# EAGLE design Galago-0BAB040D (EAGLE 5.10)
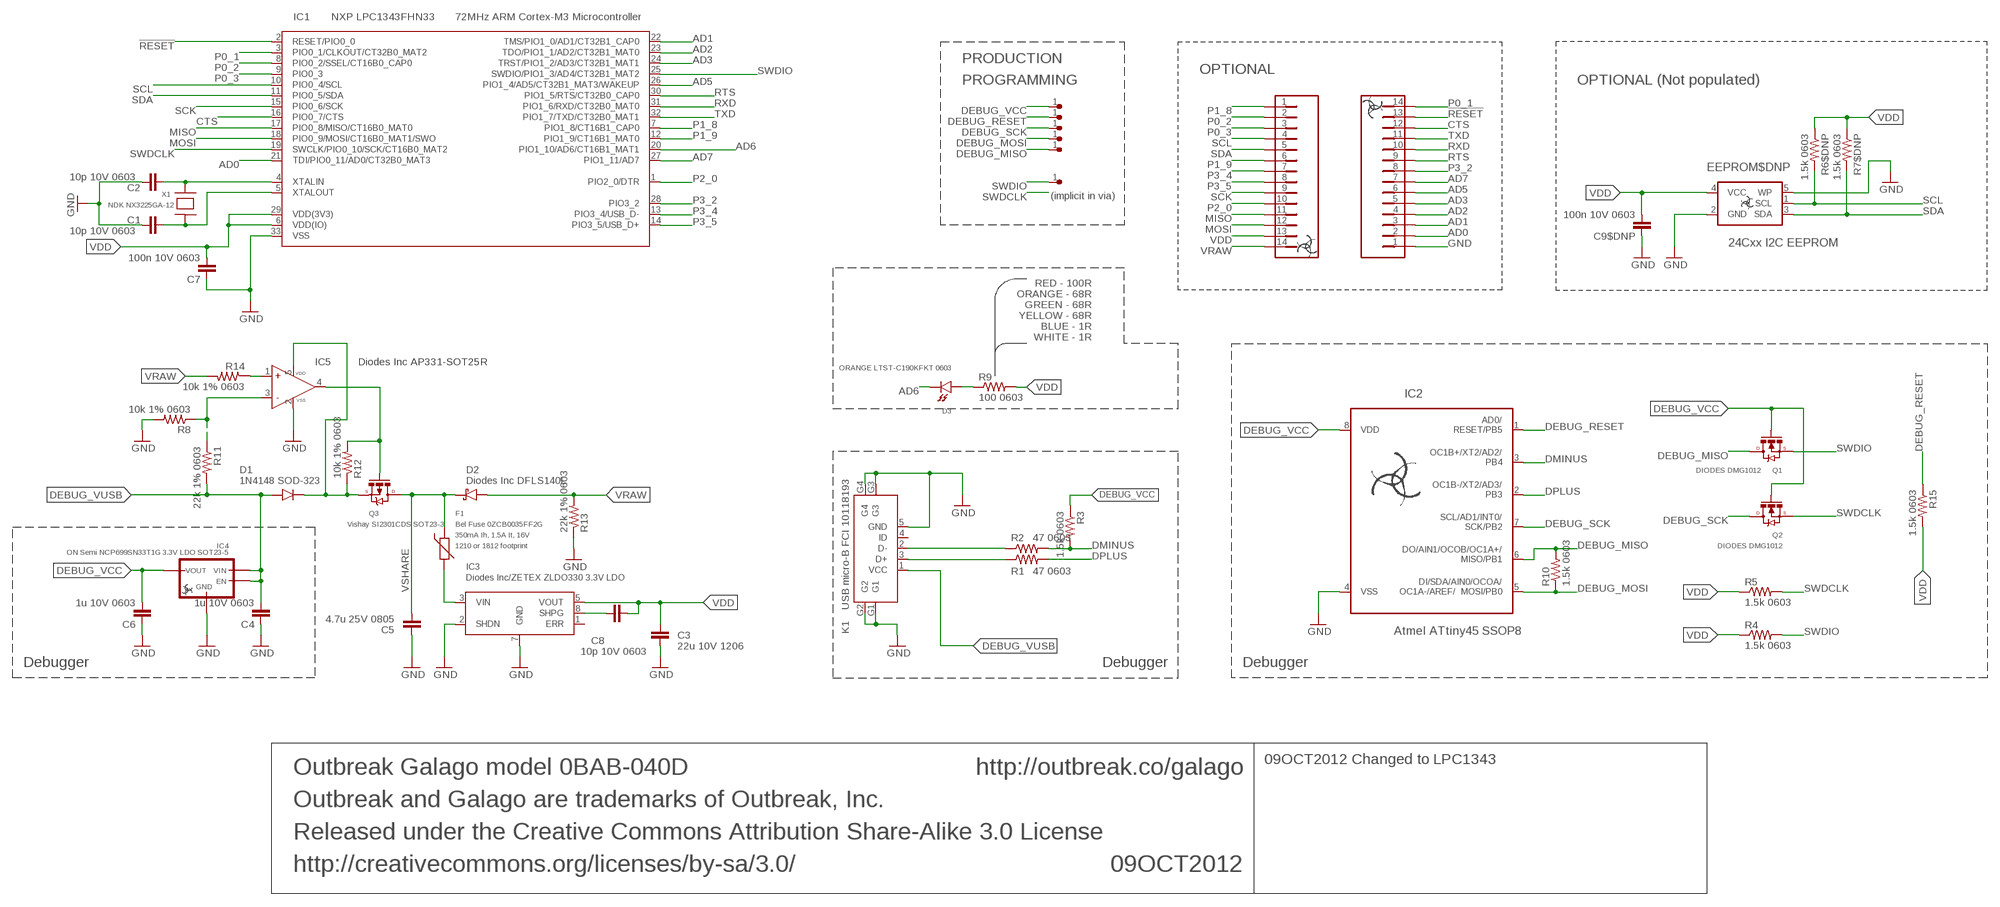
[diagram p0: schematic, sheet 1]

## Parts
09OCT2012  Outbreak Galago model 0BAB-040D  INFO-BLOCK  [INFO-BLOCK]
C1  10p 10V 0603  CAP-0603  [0603]
C2  10p 10V 0603  CAP-0603  [0603]
C3  22u 10V 1206  CAP-1206  [1206]
C4  1u 10V 0603  CAP-0603  [0603]
C5  4.7u 25V 0805  CAP-0805  [0805]
C6  1u 10V 0603  CAP-0603  [0603]
C7  100n 10V 0603  CAP-0603  [0603]
C8  10p 10V 0603  CAP-0603  [0603]
C9$DNP  100n 10V 0603  CAP-0603-MIN  [0603-MIN]
D1  1N4148 SOD-323  DIODE-SOD323  [SOD-323]
D2  Diodes Inc DFLS140L  DIODE-SCHOTTKY-POWERDI-123  [DIODE-SMT-POWERDI-123]
D3  ORANGE LTST-C190KFKT 0603  LED-0603  [0603-DIODE]
EEPROM$DNP  24Cxx I2C EEPROM  EEPROM-I2C-MCP-24AAXX/24LCXX  [SOT23-5]
F1  Bel Fuse 0ZCB0035FF2G  PTC-1812-(4532-METRIC)  [1812-(4532-METRIC)-PTC]
IC1  NXP LPC1343FHN33  LPC13XXFHN33  [HVQFN33-7X7MM]
IC2  Atmel ATtiny45 SSOP8  AVR-ATTINY25/45/85-TSSOP8  [TSSOP8]
IC3  Diodes Inc/ZETEX ZLDO330 3.3V LDO  LDO-REGULATOR-FIXED-ZETEX-ZLDO  [SM8-ZETEX]
IC4  ON Semi NCP699SN33T1G 3.3V LDO SOT23-5  LDO-REGULATOR-FIXED-WITH-ENABLE-ONSEMI-NCP699  [SOT23-5]
IC5  Diodes Inc AP331-SOT25R  COMPARATOR-SINGLE-DIODES-AP331-SOT25R  [SOT23-5]
K1  USB micro-B FCI 10118193  USB-5-PIN-MICROB-FCI-10118193  [USB-MICROB-FCI-10118193]
K2$DNP  HEADER-1X14-NO-SILK-CHUNKY  [HEADER-1X14-NO-SILK-CHUNKY]
K3$DNP  HEADER-1X14-NO-SILK-CHUNKY  [HEADER-1X14-NO-SILK-CHUNKY]
Q1  DIODES DMG1012  MOSFET-N-CHANNEL-VISHAY-SI1032R-STRETCHED  [SC-75A-STRETCHED]
Q2  DIODES DMG1012  MOSFET-N-CHANNEL-VISHAY-SI1032R-STRETCHED  [SC-75A-STRETCHED]
Q3  Vishay SI2301CDS SOT23-3  MOSFET-P-CHANNEL-VISHAY-SI2301  [SOT23-3]
R1  47 0603  RESISTOR-0603  [0603]
R2  47 0603  RESISTOR-0603  [0603]
R3  1.5k 0603  RESISTOR-0603-MIN  [0603-MIN]
R4  1.5k 0603  RESISTOR-0603-MIN  [0603-MIN]
R5  1.5k 0603  RESISTOR-0603-MIN  [0603-MIN]
R6$DNP  1.5k 0603  RESISTOR-0603-MIN  [0603-MIN]
R7$DNP  1.5k 0603  RESISTOR-0603-MIN  [0603-MIN]
R8  10k 1% 0603  RESISTOR-0603-MIN  [0603-MIN]
R9  100 0603  RESISTOR-0603-MIN  [0603-MIN]
R10  1.5k 0603  RESISTOR-0603-MIN  [0603-MIN]
R11  22k 1% 0603  RESISTOR-0603-MIN  [0603-MIN]
R12  10k 1% 0603  RESISTOR-0603-MIN  [0603-MIN]
R13  22k 1% 0603  RESISTOR-0603-MIN  [0603-MIN]
R14  10k 1% 0603  RESISTOR-0603-MIN  [0603-MIN]
R15  1.5k 0603  RESISTOR-0603-MIN  [0603-MIN]
U$1  TEST-POINT  TEST-POINT-0.75MM  [TEST-POINT-0.75MM]
U$4  TEST-POINT  TEST-POINT-0.75MM  [TEST-POINT-0.75MM]
U$5  TEST-POINT  TEST-POINT-0.75MM  [TEST-POINT-0.75MM]
U$6  TEST-POINT  TEST-POINT-0.75MM  [TEST-POINT-0.75MM]
U$7  TEST-POINT  TEST-POINT-0.75MM  [TEST-POINT-0.75MM]
U$9  TEST-POINT  TEST-POINT-0.75MM  [TEST-POINT-0.75MM]
X1  NDK NX3225GA-12  CRYSTAL-NDK-NX3225GA  [CRYSTAL-NDK-NX3225GA]

## Nets
!RESET: IC1.2(RESET/PIO0_0) K3$DNP.13
AD0: IC1.21(TDI/PIO0_11/AD0/CT32B0_MAT3) K3$DNP.2
AD1: IC1.22(TMS/PIO1_0/AD1/CT32B1_CAP0) K3$DNP.3
AD2: IC1.23(TDO/PIO1_1/AD2/CT32B1_MAT0) K3$DNP.4
AD3: IC1.24(TRST/PIO1_2/AD3/CT32B1_MAT1) K3$DNP.5
AD5: IC1.26(PIO1_4/AD5/CT32B1_MAT3/WAKEUP) K3$DNP.6
AD6: D3.2(K) IC1.20(PIO1_10/AD6/CT16B1_MAT1)
AD7: IC1.27(PIO1_11/AD7) K3$DNP.7
CTS: IC1.16(PIO0_7/CTS) K3$DNP.12
DEBUG_MISO: IC2.6(MISO/PB1) Q1.3(DRAIN) R10.2 U$7.1
DEBUG_MOSI: IC2.5(MOSI/PB0) R10.1 U$6.1
DEBUG_RESET: IC2.1(RESET/PB5) R15.1 U$1.1
DEBUG_SCK: IC2.7(SCK/PB2) Q2.3(DRAIN) U$5.1
DEBUG_VCC: C6.1 IC2.8(VDD) IC4.5(VOUT) Q1.1(GATE) Q2.1(GATE) R3.1 U$9.1
DEBUG_VUSB: C4.1 D1.A IC4.1(VIN) IC4.3(EN) K1.1(VCC) R11.2
DEBUG_VUSB_PROTECT: D1.K IC5.5(VDD) Q3.2(SOURCE) R12.1
DMINUS: IC2.3(PB4) R2.2 R3.2
DMINUS_CON: K1.2(D-) R2.1
DPLUS: IC2.2(PB3) R1.2
DPLUS_CON: K1.3(D+) R1.1
GATE: IC5.4(OUT) Q3.1(GATE) R12.2
GND: C1.1 C2.1 C3.2 C4.2 C5.2 C6.2 C7.2 C9$DNP.2 EEPROM$DNP.2(GND) EEPROM$DNP.5(WP) IC1.33(VSS) IC2.4(VSS) IC3.2(SHDN) IC3.7(GND) IC4.2(GND) IC5.2(VSS) K1.5(GND) K1.G1 K1.G2 K1.G3 K1.G4 K3$DNP.1 R8.2 R13.1
IC3-SHAPING: C8.1 IC3.8(SHPG)
LED_CURRENT: D3.1(A) R9.1
MISO: IC1.17(PIO0_8/MISO/CT16B0_MAT0) K2$DNP.11
MOSI: IC1.18(PIO0_9/MOSI/CT16B0_MAT1/SWO) K2$DNP.12
P0_1: IC1.3(PIO0_1/CLKOUT/CT32B0_MAT2) K3$DNP.14
P0_2: IC1.8(PIO0_2/SSEL/CT16B0_CAP0) K2$DNP.2
P0_3: IC1.9(PIO0_3) K2$DNP.3
P1_8: IC1.7(PIO1_8/CT16B1_CAP0) K2$DNP.1
P1_9: IC1.12(PIO1_9/CT16B1_MAT0) K2$DNP.6
P2_0: IC1.1(PIO2_0/DTR) K2$DNP.10
P3_2: IC1.28(PIO3_2) K3$DNP.8
P3_4: IC1.13(PIO3_4/USB_D-) K2$DNP.7
P3_5: IC1.14(PIO3_5/USB_D+) K2$DNP.8
RTS: IC1.30(PIO1_5/RTS/CT32B0_CAP0) K3$DNP.9
RXD: IC1.31(PIO1_6/RXD/CT32B0_MAT0) K3$DNP.10
SCK: IC1.15(PIO0_6/SCK) K2$DNP.9
SCL: EEPROM$DNP.1(SCL) IC1.10(PIO0_4/SCL) K2$DNP.4 R6$DNP.2
SDA: EEPROM$DNP.3(SDA) IC1.11(PIO0_5/SDA) K2$DNP.5 R7$DNP.2
SWDCLK: IC1.19(SWCLK/PIO0_10/SCK/CT16B0_MAT2) Q2.2(SOURCE) R5.2
SWDIO: IC1.25(SWDIO/PIO1_3/AD4/CT32B1_MAT2) Q1.2(SOURCE) R4.2 U$4.1
TXD: IC1.32(PIO1_7/TXD/CT32B0_MAT1) K3$DNP.11
VCOMP: IC5.1(+) R14.1
VDD: C3.1 C7.1 C8.2 C9$DNP.1 EEPROM$DNP.4(VCC) IC1.6(VDD(IO)) IC1.29(VDD(3V3)) IC3.5(VOUT) K2$DNP.13 R4.1 R5.1 R6$DNP.1 R7$DNP.1 R9.2 R15.2
VRAW: D2.SMALL(A) K2$DNP.14 R13.2 R14.2
VREF: IC5.3(-) R8.1 R11.1
VSHARE: C5.1 D2.BIG(K) F1.2 Q3.3(DRAIN)
VSHARE_FUSED: F1.1 IC3.3(VIN)
X1: C2.2 IC1.4(XTALIN) X1.3
X2: C1.2 IC1.5(XTALOUT) X1.1
Unconnected: IC3.1(ERR) K1.4(ID)

## Notes on the sheet
- 72MHz ARM Cortex-M3 Microcontroller
- PRODUCTION
- OPTIONAL
- PROGRAMMING | OPTIONAL (Not populated)
- (implicit in via)
- RED - 100R
- ORANGE - 68R
- GREEN - 68R
- YELLOW - 68R
- BLUE - 1R
- WHITE - 1R
- 350mA Ih, 1.5A It, 16V
- 1210 or 1812 footprint
- Debugger | Debugger | Debugger
- 09OCT2012 Changed to LPC1343

## Library data of the parts
09OCT2012 = Outbreak:INFO-BLOCK
C1-C8 C9$DNP = Outbreak:CAP
D1 = Outbreak:DIODE
D2 = Outbreak:DIODE-SCHOTTKY
D3 = Outbreak:LED
EEPROM$DNP = Outbreak:EEPROM-I2C
F1 = Outbreak:PTC
IC1 = Outbreak:LPC13XXFHN33: LPC1313 72 MHz 32-bit ARM Cortex-M3 based microcontroller featuring a high level of integration and low power consumption. 32 kB Flash, 8 kB SRAM MarcVl - Datasheet available on www.nxp.com
IC2 = Outbreak:AVR-ATTINY25/45/85
IC3 = Outbreak:LDO-REGULATOR-FIXED-ZETEX-ZLDO: ZETEX ULTRA LOW DROPOUT REGULATOR Ultra-low-dropout linear regulator Vin = [0V, 20V], Vout = 3.3V; Vin - 100mV when 0V < Vin < 3.4V Imax = 300mA continuous The shutdown pin (2, 'SHDN') is an active-high logic-level input: 0 - regulator active 1 - shutdown If not used, tie to GND The low battery flag (1, ERR) is an open-collector NPN driver which pulls low when the voltage drop across the regulator has fallen to less than 300mV. Not useful for very-low-dropout scenarios but can provide advance warning of battery failure for e.g. LiIon-to-3.3V use cases. Leave floating if not used. Pin 4 is internally N/C and my be connected in any fashion. Pin 6 is DNC and must be left floating.
IC4 = Outbreak:LDO-REGULATOR-FIXED-WITH-ENABLE: Low Drop-Out (LDO) Volt Regulator with enable pin (active at logic high.)
IC5 = Outbreak:COMPARATOR-SINGLE
K1 = Outbreak:USB-5-PIN
K2$DNP K3$DNP = Outbreak:HEADER-1X14-NO-SILK
Q1 Q2 = Outbreak:MOSFET-N-CHANNEL
Q3 = Outbreak:MOSFET-P-CHANNEL
R1-R5 R6$DNP R7$DNP R8-R15 = Outbreak:RESISTOR: Resistor Basic schematic elements and footprints for 0603, 1206, and PTH resistors.
U$1 U$4-U$7 U$9 = Outbreak:TEST-POINT
X1 = Outbreak:CRYSTAL

## Board
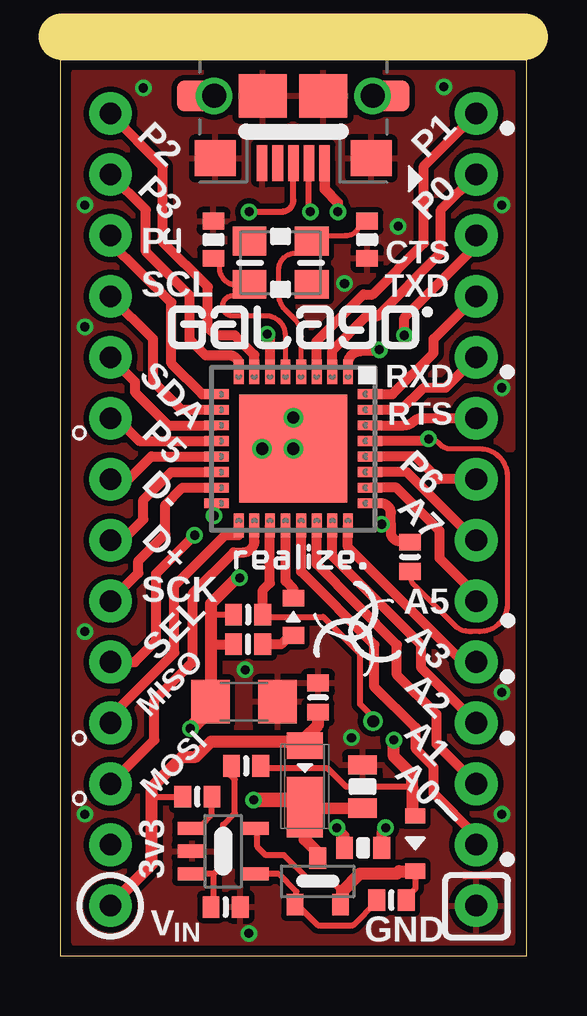
[diagram p1: board, top side]
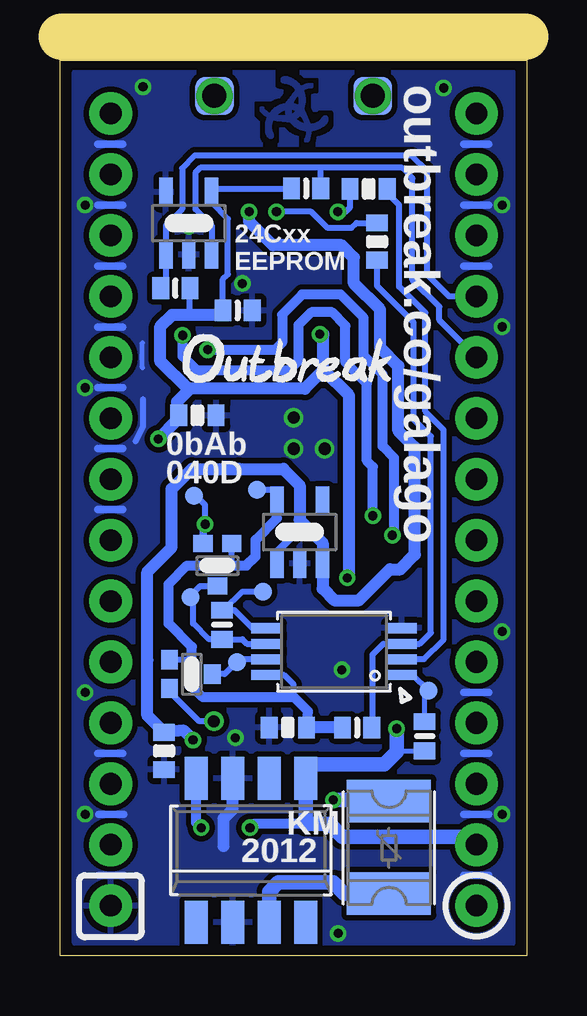
[diagram p2: board, bottom side, seen from below]

Size 19.46 x 37.34 mm. Coordinates in mm from the lower left corner, seen from the top.
Outline: 0,0 19.46,0 19.46,37.34 0,37.34 0,0
Copper layers (1*16): Top 0.035mm / dielectric 1.5mm / Bottom 0.035mm
Design rules "default *": minimum track width 8mil, minimum drill 15mil, track to track 8mil, track to pad 8mil, pad to pad 8mil, via to via 8mil, smd to smd 8mil, copper to edge 16mil, drill to drill 8mil, minimum pad ring 10mil, minimum via ring 6mil, stop-mask expansion 4mil, vias tented up to drill 25mil, thermal gap 10mil
tRestrict: area 12.3,15.7 to 12.3,16.5
Milling: 1 lines

### Footprints (pad centres in the part's own frame; a part is rotated, then mirrored left to right if it is on the bottom)
0603 = smd 0.7 x 0.9: 1 -0.777,0; 2 0.777,0
1206 = smd 1.6 x 1.8: 1 -1.4,0; 2 1.4,0
0805 = smd 0.8 x 1.2: 1 -0.9,0; 2 0.9,0
0603-MIN = smd 0.7 x 0.9: 1 -0.61,0; 2 0.61,0
SOD-323 = smd 0.63 x 0.83: A -1.15,0; K 1.15,0
DIODE-SMT-POWERDI-123 = smd 2.52 x 1.5: BIG 0.87,0 | smd 1.1 x 1.5: SMALL -1.69,0
0603-DIODE = smd 0.7 x 0.9: 1 -0.777,0; 2 0.777,0
SOT23-5 = smd 0.55 x 1.2: 1 0.95,1.3; 2 0,1.3; 3 -0.95,1.3; 4 -0.95,-1.3; 5 0.95,-1.3
1812-(4532-METRIC)-PTC = smd 1.78 x 3.5: 1 -1.922,0.002; 2 1.938,0.002
HVQFN33-7X7MM = smd 1.013 x 0.406: 1 -3.2,2.275; 2 -3.2,1.625; 3 -3.2,0.975; 4 -3.2,0.325; 5 -3.2,-0.325; 6 -3.2,-0.975; 7 -3.2,-1.625; 8 -3.2,-2.275; 17 3.2,-2.275; 18 3.2,-1.625; 19 3.2,-0.975; 20 3.2,-0.325; 21 3.2,0.325; 22 3.2,0.975; 23 3.2,1.625; 24 3.2,2.275 | smd 0.406 x 1.013: 9 -2.275,-3.2; 10 -1.625,-3.2; 11 -0.975,-3.2; 12 -0.325,-3.2; 13 0.325,-3.2; 14 0.975,-3.2; 15 1.625,-3.2; 16 2.275,-3.2; 25 2.275,3.2; 26 1.625,3.2; 27 0.975,3.2; 28 0.325,3.2; 29 -0.325,3.2; 30 -0.975,3.2; 31 -1.625,3.2; 32 -2.275,3.2 | smd 4.5 x 4.5: 33 0,0
TSSOP8 = smd 1.25 x 0.42: 1 -2.825,0.975; 2 -2.825,0.325; 3 -2.825,-0.325; 4 -2.825,-0.975; 5 2.825,-0.975; 6 2.825,-0.325; 7 2.825,0.325; 8 2.825,0.975
SM8-ZETEX = smd 0.95 x 1.8: 1 2.28,3; 2 0.76,3; 3 -0.76,3; 4 -2.28,3; 5 -2.28,-3; 6 -0.76,-3; 7 0.76,-3; 8 2.28,-3
USB-MICROB-FCI-10118193 = smd 0.44 x 1.5: 1 -1.3,2.8; 2 -0.65,2.8; 3 0,2.8; 4 0.65,2.8; 5 1.3,2.8 | smd 1.7 x 1.5: G1 -3.25,2.6; G4 3.25,2.6 | smd 2 x 1.8: G2 -1.255,0; G3 1.275,0 | smd 1.6 x 1.6 bottom: G5 -3.3,0; G7 3.3,0 | smd 1.5 x 1.3: G6 -4.1,0; G8 4.1,0 | drill 1 pad 1.524 round: P$1 -3.3,0; P$2 3.3,0
HEADER-1X14-NO-SILK-CHUNKY = drill 0.9 pad 1.778 round: 1 0,0; 2 2.54,0; 3 5.08,0; 4 7.62,0; 5 10.16,0; 6 12.7,0; 7 15.24,0; 8 17.78,0; 9 20.32,0; 10 22.86,0; 11 25.4,0; 12 27.94,0; 13 30.48,0; 14 33.02,0
SC-75A-STRETCHED = smd 0.8 x 0.7: 1 0.6,0.926; 2 -0.6,0.926; 3 0,-0.851
SOT23-3 = smd 0.7 x 0.9: 1 0.95,0.97; 2 -0.95,0.97; 3 0,-0.97
TEST-POINT-0.75MM = smd 0.75 x 0.75: 1 0,0
CRYSTAL-NDK-NX3225GA = smd 1.4 x 1.2: 1 -1.3,-0.9; 2 1.3,-0.9; 3 1.3,0.9; 4 -1.3,0.9

### Placement (x,y rotation side)
09OCT2012  -10.16,-1.65 0 top  (outside the outline)
C1  6.39,29.84 270 top
C2  12.8,29.84 90 top
C3  7.66,10.59 0 top
C4  15.12,8.53 270 bottom
C5  12.61,7.05 90 top
C6  9.96,9.51 180 bottom
C7  13.73,22.52 0 bottom
C8  12.63,4.5 180 top
C9$DNP  12.06,26.9 0 bottom
D1  14.8,4.67 270 top
D2  10.19,7.06 270 top
D3  9.72,14.12 90 top
EEPROM$DNP  14.09,30.53 180 bottom
F1  5.75,4.51 90 bottom
IC1  9.72,21.13 270 top
IC2  8.04,12.68 180 bottom
IC3  11.5,4.39 180 bottom
IC4  9.47,17.65 180 bottom
IC5  6.8,4.36 90 top
K1  9.72,35.84 180 top
K2$DNP  2.1,35.1 270 top
K3$DNP  17.34,2.08 90 top
Q1  12.9,16.26 0 bottom
Q2  13.96,11.73 90 bottom
Q3  10.74,3.1 180 top
R1  6.6,31.97 0 bottom
R2  6.24,29.77 270 bottom
R3  7.08,9.51 0 bottom
R4  14.59,16.62 90 top
R5  7.84,14.22 0 top
R6$DNP  14.65,27.83 180 bottom
R7$DNP  9.2,31.98 0 bottom
R8  6.9,2.03 0 top
R9  7.84,12.98 180 top
R10  12.71,13.79 270 bottom
R11  7.75,7.91 0 top
R12  13.81,2.31 180 top
R13  10.75,10.76 270 top
R14  5.72,6.63 180 top
R15  4.26,9.14 270 bottom
U$1  4.1,11.05 0 bottom
U$4  13.88,19.16 0 bottom
U$5  12.08,12.24 0 bottom
U$6  11.01,15.18 0 bottom
U$7  14.01,14.94 0 bottom
U$9  11.25,19.42 0 bottom
X1  9.19,28.88 0 top

### Tracks (layer width: path | path; a pad name or v marks a point on that pad's centre or on a via)
!RESET
  Top 0.406: IC1.2 11.35,25.22 12.77,26.67 13.24,26.67 15.87,29.3 15.87,31.09 K3$DNP.13
AD0
  Top 0.406: IC1.21 10.05,16.01 13.1,12.95 13.1,11.2 14.83,9.5 14.83,8.62 15.56,7.86 15.56,6.76 17.34,4.98 K3$DNP.2
AD1
  Top 0.406: IC1.22 10.7,16.32 14.04,12.95 14.04,11.71 15.69,10.06 15.69,8.81 K3$DNP.3
AD2
  Top 0.406: IC1.23 11.35,16.66 15.06,12.95 15.06,11.99 K3$DNP.4
AD3
  Top 0.406: IC1.24 12,17.03 16.78,12.24 K3$DNP.5
AD5
  Top 0.406: IC1.26 14.01,19.51 15.82,17.7 15.82,16.56 17.34,15.04 K3$DNP.6
AD6
  Top 0.406: IC1.20 9.4,15.61 9.72,15.29 D3.2
AD7
  Top 0.406: IC1.27 14.46,20.16 17.29,17.32 K3$DNP.7
CTS  (via drill 0.38)
  Top 0.406: v14.35,25.86 14.35,26.59 17.34,29.59 K3$DNP.12 | IC1.16 6.42,18.86 v6.42,18.34
  Bottom 0.406: v14.35,25.86 14.35,24.99 13.74,24.38 9.93,24.38 9.52,24.79 9.52,26.29 8.99,26.82 8.12,26.82 7.56,26.26 7.56,24.74 6.67,23.85 6.67,20.62 6.42,20.37 v6.42,18.34
DEBUG_MISO
  Bottom 0.254: Q1.3 13.62,15.4 13.91,15.11 13.91,14.99 | 13.91,14.99 13.91,13.84 13.26,13.18 R10.2 11.86,13.18 11.68,13 IC2.6 | U$7.1 13.96,14.99 13.91,14.99
DEBUG_MOSI
  Bottom 0.254: 10.99,15.18 U$6.1 11.85,15.18 12.62,14.4 R10.1 | R10.1 12.71,14.32 | IC2.5 11.44,13.65 12.19,14.4 R10.1
DEBUG_RESET
  Bottom 0.203: R15.1 4.26,10.88 U$1.1
  Bottom 0.254: IC2.1 4.75,11.7 U$1.1
DEBUG_SCK
  Bottom 0.254: 13.16,11.61 Q2.3 12.59,11.73 U$5.1 11.94,12.35 IC2.7
DEBUG_VCC
  Bottom 0.254: 10.47,18.9 IC4.5 10.42,19.42 U$9.1 | 12.3,16.26 Q1.1 | Q2.1 14.81,12.32 13.96,12.32 | IC2.8 10.12,11.7 9.72,11.3 9.72,10.79 9.7,10.77
  Bottom 0.406: IC4.5 10.42,18.23 11.31,17.34 11.31,16.64 11.69,16.26 12.3,16.26 14.17,16.26 14.93,15.49 14.93,13.84 13.96,12.88 13.96,12.32 13.96,11.23 13.51,10.77 9.7,10.77 9.11,10.19 C6.1
  Bottom 0.508: R3.1 9.11,9.51 C6.1
DEBUG_VUSB  (via drill 0.38)
  Top 0.254: 14.68,7.05 11.91,7.05 11.13,7.82 8.3,7.82 R11.2
  Top 0.437: K1.1 11.02,31.95 11.58,31.39 v11.58,31.01
  Top 0.508: v13.91,8.99 13.91,8.31 14.68,7.54 14.68,7.05 14.68,5.85 D1.A
  Bottom 0.254: 12.01,20.3 12.13,20.3 | 15.82,12.32 15.82,12.34
  Bottom 0.305: IC4.1 10.42,16.83 9.28,17.97
  Bottom 0.508: v11.58,31.01 11.58,30.61 10.59,29.62 7.72,29.62 7.21,29.11 7.21,28.02 6.12,26.92 6.12,25.35 5.35,24.59 5.35,21.87 4.67,21.18 4.67,16.71 5.28,16.1 5.71,16.1 7,14.81 8.02,14.81 8.52,15.31 IC4.3 8.52,17.21 9.28,17.97 9.47,18.16 9.47,19.61 10.15,20.3 12.01,20.3 13.96,20.3 14.8,19.46 14.8,17.02 15.82,16 15.82,12.32 15.82,10.01 15.32,9.51 C4.1 14.31,9.38 v13.91,8.99
DEBUG_VUSB_PROTECT
  Top 0.254: 11.75,2.66 11.24,3.17 10.36,3.17 9.34,4.19 8.58,4.19 8.23,4.54 8.23,5.31 IC5.5 | D1.K 14.8,2.79 14.42,2.41 R12.1
  Top 0.508: Q3.2 11.75,2.13 11.75,2.66 12.51,3.42 14.03,3.42 14.13,3.52 D1.K
DMINUS
  Bottom 0.254: R2.2 6.24,27.91 4.72,26.39 4.72,22.35 4.01,21.64 4.01,13.46 4.47,13 IC2.3 5.98,13 6.43,12.55 6.43,9.61 6.56,9.61 R3.2
DMINUS_CON  (via drill 0.38)
  Top 0.254: v10.43,31.01 10.37,31.07 K1.2
  Bottom 0.254: R2.1 7.09,30.55 7.31,30.33 8.3,30.33 8.99,31.01 v10.43,31.01
DPLUS
  Bottom 0.254: R1.2 5.82,31.79 5.33,31.29 5.33,27.89 4.24,26.8 4.24,22.68 3.47,21.92 3.47,13.17 4.29,12.35 IC2.2
DPLUS_CON  (via drill 0.38)
  Top 0.254: v7.88,31.01 9.24,31.01 arc90 9.72,31.5 K1.3
  Bottom 0.254: R1.1 7.38,31.19 7.55,31.01 v7.88,31.01
GATE
  Top 0.254: IC5.4 9.11,3.41 9.85,2.66 9.85,2.13 Q3.1 9.88,2.13 10.74,1.27 12.21,1.27 13.2,2.26 R12.2
GND  (via drill 0.38, 0.51)
  Top 0.254: IC1.33 10.55,21.74 10.59,22.48
  Top 0.305: 16.83,3.35 17.88,3.35
  Top 0.406: K1.5 8.42,33.53
  Bottom 0.203: 16.02,24.51 16.02,25.55
  Bottom 0.254: 16.3,21.44 16,22.07 16,23.19
  Bottom 0.305: 16.83,18.59 17.88,18.59 | 16.83,21.13 17.88,21.13 | 16.83,23.67 17.88,23.67 | 16.83,28.75 17.88,28.75 | 1.59,10.97 2.64,10.97 | 16.81,5.89 17.85,5.89 | 1.59,31.29 2.64,31.29 | 1.59,28.75 2.64,28.75 | 1.59,5.89 2.64,5.89 | 1.59,3.35 2.64,3.35 | 1.59,8.43 2.64,8.43 | 16.83,8.43 17.88,8.43 | 1.59,33.83 2.64,33.83 | 16.83,33.83 17.88,33.83 | 16.83,31.29 17.88,31.29 | 16.81,3.35 17.85,3.35 | 16.83,26.21 17.88,26.21
  Bottom 0.508: IC3.7 12.26,6.1 12.64,5.71 12.64,4.57
  other vias: 1.04,31.29 18.41,31.29 18.41,23.67 1.04,26.21 1.04,13.51 18.41,5.89 18.41,10.97 3.47,36.17 16,36.22 9.72,21.13 14.09,30.4 11.86,28.02 7.72,11.91 8.43,21.13 9.72,22.43 1.04,5.89 12.15,9.08 7.87,0.93
  pour Top (isolate 0.229): 0.6,36.83 7.82,36.83 7.82,32.38 8.83,32.38 8.83,34.16 8.21,34.16 7.83,33.78 7.83,36.83 18.84,36.83 18.84,21.11 13.13,21.11 13.13,24.51 6.34,24.51 6.34,21.21 0.6,21.21
  pour Top (isolate 0.229, rank 2): 18.84,21.11 18.84,0.53 0.6,0.53 0.6,21.21 6.37,21.21 6.37,17.78 13.1,17.78 13.1,21.11
  pour Bottom (isolate 0.229, rank 3): 0.6,36.83 0.6,0.53 18.84,0.53 18.84,36.83
IC3-SHAPING  (via drill 0.38)
  Top 0.406: C8.1 13.41,5.17 v13.57,5.33
  Bottom 0.406: IC3.8 13.78,5.54 v13.57,5.33
LED_CURRENT
  Top 0.406: R9.1 9.21,12.98 9.57,13.34 9.71,13.34 D3.1
MISO
  Top 0.406: K2$DNP.11 2.1,9.96 4.77,12.62 4.77,15.42 6.88,17.53 7.45,17.53 IC1.17
MOSI
  Top 0.406: K2$DNP.12 3.93,8.99 3.93,10.64 5.53,12.24 5.53,15.11 7.23,16.82 7.64,16.82 arc90 8.1,17.27 IC1.18
N$1
  pour Bottom (isolate 0.229, rank 2): 9.21,34.67 10.61,34.67 10.61,33.78 9.21,33.78
N$30
  pour Bottom: 11.02,35.22 10.99,35.2 10.93,35.14 10.87,35.09 10.81,35.05 10.75,35.01 10.72,35 10.71,35.01 10.74,35.03 10.78,35.05 10.83,35.07 10.87,35.1 10.91,35.13 10.94,35.17 10.98,35.2 11.01,35.24 11.04,35.28 11.04,35.28 11.04,35.29 11.04,35.31 11.04,35.31 11.04,35.32 11.05,35.33 11.04,35.33 11.05,35.33 11.05,35.33 11.06,35.32 11.06,35.32 11.07,35.31 11.06,35.29 11.06,35.27 11.05,35.26 11.04,35.25 11.04,35.25 11.03,35.24
N$31
  pour Bottom: 10.62,34.93 10.61,34.94 10.58,34.98 10.58,34.98 10.57,35 10.53,35.05 10.48,35.1 10.43,35.15 10.38,35.19 10.32,35.23 10.26,35.27 10.2,35.3 10.13,35.32 10.13,35.32 10.05,35.35 10.05,35.35 10.05,35.37 10.05,35.39 10.05,35.41 10.04,35.44 10.08,35.43 10.14,35.42 10.14,35.42 10.22,35.39 10.3,35.36 10.37,35.33 10.44,35.28 10.51,35.23 10.57,35.18 10.62,35.11 10.67,35.04 10.69,35.01 10.71,34.98 10.71,34.97 10.74,34.91 10.76,34.86 10.78,34.81 10.79,34.76 10.8,34.71 10.81,34.65 10.82,34.6 10.82,34.54 10.82,34.47 10.82,34.42 10.81,34.37 10.81,34.32 10.8,34.28 10.79,34.25 10.77,34.23 10.76,34.21 10.74,34.19 10.73,34.19 10.71,34.18 10.71,34.17 10.7,34.16 10.7,34.16 10.68,34.16 10.67,34.16 10.67,34.16 10.65,34.16 10.63,34.17 10.63,34.17 10.64,34.18 10.64,34.19 10.65,34.21 10.66,34.23 10.68,34.31 10.7,34.38 10.72,34.44 10.72,34.5 10.73,34.56 10.73,34.62 10.72,34.67 10.71,34.73 10.69,34.78 10.67,34.83 10.62,34.93
N$32
  pour Bottom: 10.54,34.96 10.54,34.96 10.57,34.97 10.58,34.94 10.56,34.93 10.48,34.91 10.4,34.9 10.32,34.89 10.25,34.88 10.18,34.87 10.11,34.87 10.06,34.86 10,34.85 9.96,34.85 9.91,34.84 9.87,34.84 9.83,34.84 9.8,34.84 9.77,34.84 9.75,34.85 9.74,34.87 9.74,34.87 9.73,34.88 9.71,34.91 9.7,34.94 9.68,34.96 9.65,34.98 9.64,34.99 9.62,34.99 9.61,35 9.61,35 9.61,35 9.58,35.03 9.54,35.06 9.51,35.1 9.48,35.14 9.48,35.15 9.48,35.15 9.47,35.15 9.53,35.2 9.53,35.2 9.56,35.16 9.58,35.12 9.61,35.09 9.64,35.07 9.67,35.05 9.71,35.03 9.76,35.01 9.81,34.99 9.8,34.99 9.82,34.98 9.86,34.97 9.91,34.96 9.93,34.96 10.02,34.94 10.12,34.93 10.21,34.93 10.3,34.93 10.37,34.93 10.43,34.94 10.49,34.95
N$33
  pour Bottom: 9.99,35.47 10.01,35.45 10.01,35.45 10.02,35.42 10.03,35.39 10.03,35.37 10.02,35.35 10.02,35.35 10.01,35.34 10.01,35.33 9.99,35.3 9.98,35.28 9.98,35.25 9.97,35.23 9.97,35.23 9.97,35.2 9.97,35.19 9.97,35.17 9.97,35.13 9.96,35.09 9.94,35.05 9.92,35 9.91,34.98 9.91,34.98 9.91,34.98 9.87,34.99 9.84,35 9.86,35.03 9.88,35.07 9.89,35.1 9.9,35.14 9.9,35.16 9.9,35.2 9.9,35.24 9.9,35.29 9.89,35.34 9.89,35.34 9.88,35.36 9.86,35.46 9.85,35.49 9.82,35.57 9.78,35.65 9.74,35.73 9.69,35.81 9.65,35.87 9.62,35.92 9.57,35.97 9.53,36.02 9.53,36.02 9.54,36.05 9.55,36.04 9.55,36.04 9.61,35.98 9.66,35.91 9.71,35.85 9.76,35.79 9.8,35.73 9.84,35.68 9.87,35.63 9.9,35.59 9.93,35.55 9.96,35.52 9.98,35.49
N$34
  pour Bottom: 9.5,36.03 9.49,36 9.47,35.94 9.45,35.87 9.43,35.81 9.42,35.74 9.42,35.67 9.42,35.61 9.42,35.54 9.43,35.47 9.45,35.4 9.46,35.38 9.44,35.37 9.42,35.36 9.4,35.34 9.38,35.32 9.38,35.33 9.35,35.42 9.35,35.42 9.33,35.51 9.32,35.59 9.31,35.68 9.32,35.76 9.33,35.84 9.35,35.93 9.38,36.01 9.42,36.09 9.43,36.1 9.45,36.14 9.46,36.17 9.49,36.2 9.52,36.24 9.55,36.28 9.59,36.32 9.63,36.35 9.67,36.39 9.72,36.42 9.77,36.46 9.83,36.49 9.88,36.51 9.92,36.53 9.96,36.55 10,36.56 10.04,36.57 10.06,36.57 10.09,36.56 10.11,36.56 10.11,36.55 10.12,36.55 10.14,36.55 10.14,36.54 10.15,36.54 10.16,36.54 10.16,36.54 10.17,36.53 10.18,36.51 10.18,36.5 10.18,36.49 10.18,36.48 10.18,36.47 10.17,36.47 10.16,36.47 10.14,36.47 10.12,36.46 10.03,36.45 9.96,36.43 9.96,36.43 9.91,36.41 9.85,36.39 9.8,36.36 9.75,36.33 9.71,36.3 9.66,36.26 9.63,36.22 9.59,36.17 9.55,36.11 9.53,36.07 9.53,36.07 9.5,36.03
N$35
  pour Bottom: 9.42,36.14 9.41,36.12 9.39,36.14 9.34,36.17 9.3,36.19 9.26,36.21 9.21,36.23 9.16,36.25 9.12,36.26 9.07,36.27 9.02,36.27 9.01,36.27 8.99,36.26 8.98,36.26 8.97,36.25 8.97,36.25 8.97,36.26 8.97,36.27 8.98,36.28 9,36.29 9.03,36.29 9.03,36.29 9.04,36.29 9.05,36.29 9.06,36.28 9.08,36.28 9.08,36.28 9.11,36.27 9.19,36.25 9.27,36.22 9.34,36.19 9.4,36.15
N$36
  pour Bottom: 9.81,34.81 9.74,34.74 9.67,34.68 9.61,34.62 9.54,34.58 9.46,34.54 9.38,34.51 9.3,34.49 9.22,34.47 9.13,34.47 9.11,34.47 9.11,34.47 9.07,34.47 9.04,34.47 9.04,34.47 9,34.47 9,34.47 8.95,34.48 8.9,34.49 8.84,34.5 8.79,34.52 8.74,34.54 8.69,34.56 8.63,34.59 8.58,34.62 8.53,34.65 8.49,34.68 8.45,34.71 8.43,34.73 8.4,34.76 8.39,34.78 8.38,34.81 8.38,34.83 8.38,34.83 8.38,34.84 8.37,34.86 8.37,34.87 8.37,34.88 8.37,34.88 8.37,34.89 8.38,34.91 8.38,34.91 8.39,34.92 8.4,34.93 8.4,34.93 8.41,34.93 8.42,34.93 8.43,34.92 8.44,34.9 8.45,34.88 8.45,34.88 8.51,34.82 8.56,34.76 8.6,34.72 8.65,34.69 8.7,34.66 8.75,34.63 8.8,34.61 8.86,34.59 8.91,34.58 8.97,34.57 9.06,34.57 9.09,34.57 9.14,34.57 9.14,34.57 9.14,34.57 9.16,34.57 9.23,34.58 9.29,34.59 9.36,34.61 9.42,34.64 9.49,34.67 9.55,34.7 9.6,34.74 9.66,34.79 9.72,34.85 9.74,34.83 9.76,34.82 9.78,34.82
N$37
  pour Bottom: 9.18,33.99 9.17,33.99 9.16,34 9.15,34.01 9.15,34.03 9.14,34.03 9.14,34.04 9.14,34.06 9.13,34.07 9.12,34.11 9.1,34.19 9.09,34.27 9.08,34.35 9.08,34.43 9.08,34.44 9.1,34.44 9.1,34.41 9.1,34.36 9.1,34.31 9.1,34.26 9.11,34.22 9.12,34.17 9.13,34.12 9.15,34.07 9.17,34.03 9.17,34.02 9.18,34.02 9.19,34.01 9.19,34.01 9.2,34 9.21,34 9.21,34 9.21,33.99 9.2,33.99 9.2,33.99 9.19,33.98
N$38
  pour Bottom: 9.14,34.61 9.14,34.61 9.13,34.59 9.1,34.59 9.11,34.62 9.13,34.69 9.16,34.77 9.19,34.84 9.22,34.91 9.25,34.97 9.27,35.03 9.3,35.09 9.32,35.14 9.34,35.18 9.35,35.22 9.35,35.22 9.36,35.25 9.38,35.27 9.39,35.3 9.41,35.32 9.43,35.34 9.45,35.35 9.47,35.36 9.47,35.36 9.47,35.36 9.48,35.36 9.49,35.36 9.53,35.36 9.55,35.36 9.58,35.37 9.6,35.38 9.6,35.38 9.62,35.39 9.63,35.4 9.64,35.4 9.65,35.41 9.65,35.41 9.68,35.42 9.72,35.43 9.76,35.44 9.81,35.44 9.84,35.45 9.83,35.45 9.84,35.45 9.86,35.37 9.82,35.37 9.82,35.37 9.78,35.37 9.75,35.36 9.71,35.36 9.68,35.34 9.69,35.35 9.65,35.33 9.61,35.3 9.57,35.27 9.53,35.24 9.52,35.23 9.52,35.23 9.45,35.16 9.44,35.14 9.38,35.07 9.33,35 9.28,34.92 9.23,34.84 9.2,34.78 9.18,34.72 9.15,34.66
P0_1
  Top 0.406: IC1.3 10.7,25.61 12.64,27.56 13.02,27.56 15.16,29.69 15.16,32.92 K3$DNP.14
P0_2
  Top 0.406: IC1.8 7.45,24.65 arc90 7.08,25.02 6.07,25.02 5.4,25.68 5.4,27.52 3.58,29.35 3.58,31.09 K2$DNP.2
P0_3
  Top 0.406: IC1.9 5.92,23.41 4.64,24.69 4.64,27.23 2.1,29.72 K2$DNP.3
P1_8
  Top 0.406: IC1.7 8.1,25.04 7.28,25.86 6.52,25.86 6.17,26.21 6.17,27.89 4.29,29.74 4.29,32.89 K2$DNP.1
P1_9
  Top 0.406: IC1.12 3.3,21.46 2.36,22.4 K2$DNP.6
P2_0  (via drill 0.38)
  Top 0.406: v5.61,17.53 4.01,15.93 4.01,13.13 3.12,12.24 K2$DNP.10 | IC1.1 12,24.68 arc-90 12.52,25.2 13.19,25.2 arc53 v13.3,25.26
  Bottom 0.406: v5.61,17.53 5.53,17.6 5.53,20.75 6.01,21.23 6.01,24.23 6.8,25.02 6.8,26.59 7.77,27.56 9.37,27.56 10.21,26.72 10.21,25.55 10.51,25.25 13.28,25.25 v13.3,25.26
P3_2
  Top 0.406: IC1.28 14.82,20.81 15.77,19.86 K3$DNP.8
P3_4
  Top 0.406: IC1.13 3.81,20.81 2.86,19.86 K2$DNP.7
P3_5
  Top 0.406: IC1.14 4.63,20.16 3.47,19 3.47,18.19 2.61,17.32 K2$DNP.8
RTS
  Top 0.406: IC1.30 14.33,22.11 arc42 14.7,22.25 arc-45 15.13,22.4 K3$DNP.9
RXD
  Top 0.406: IC1.31 14.22,22.76 15.16,23.67 16.07,23.67 K3$DNP.10
SCK
  Top 0.406: IC1.15 5.1,19.51 4.39,18.8 4.39,17.58 3.27,16.46 3.27,15.95 K2$DNP.9
SCL
  Top 0.406: IC1.10 5.05,22.76 3.88,23.93 3.88,25.7 K2$DNP.4
  Bottom 0.254: K2$DNP.4 3.25,27.48 4.16,28.4 4.16,32.72 4.79,33.35 13.84,33.35 14.37,32.82 14.37,31.11 15.04,30.44 EEPROM$DNP.1 15.04,28.01 R6$DNP.2
SDA
  Top 0.406: IC1.11 4.5,22.11 3.12,23.5 3.12,23.93 K2$DNP.5
  Bottom 0.254: K2$DNP.5 3.65,26.49 3.65,27.05 4.77,28.17 4.77,32.41 5.2,32.84 8.6,32.84 | 8.6,32.84 13.61,32.84 13.81,32.64 13.81,31.11 13.14,30.44 EEPROM$DNP.3 | 8.6,32.84 R7$DNP.2
SWDCLK  (via drill 0.51)
  Top 0.254: R5.2 8.64,14.12 10.97,14.12 12.49,12.6 12.49,10.49 13.05,9.93 v13.05,9.77
  Top 0.406: IC1.19 8.75,15.54 8.45,15.24 R5.2
  Bottom 0.254: v13.05,9.77 13.65,9.77 14.81,10.93 Q2.2
SWDIO  (via drill 0.38)
  Top 0.406: IC1.25 13.37,18.86 arc-90 13.79,18.44 13.79,17.98 | 13.79,17.98 13.79,17.65 arc90 14.17,17.27 R4.2 | v13.4,17.98 13.79,17.98
  Bottom 0.254: U$4.1 13.77,19.16 13.4,18.8 v13.4,17.98
  Bottom 0.305: Q1.2 13.5,17.89 v13.4,17.98
TXD
  Top 0.406: IC1.32 13.85,23.41 15.56,25.12 15.56,25.7 K3$DNP.11
VCOMP
  Top 0.254: IC5.1 5.88,5.31 5.88,5.43 6.33,5.88 R14.1
VDD  (via drill 0.38)
  Top 0.203: v15.36,21.54 arc-54 15.82,21.34 arc50 16.28,21.13 17.5,21.13 arc-90 18.64,19.99 18.64,14.63 arc-90 17.47,13.51 17.14,13.51 arc-43 16.49,13.72 14.81,15.4 arc-57 14.6,15.89 14.6,16.06 R4.1
  Top 0.254: 6.29,14.21 R5.1
  Top 0.406: IC1.29 15.28,21.46 v15.36,21.54 | v8.63,25.91 8.75,25.79 IC1.6 | C8.2 11.85,5.01 v11.54,5.33 | 6.29,12.98 R9.2
  Top 0.508: 6.51,10.52 6.42,10.52 C3.1 6.29,10.59 6.29,12.98 6.29,14.21 6.29,14.68 7.36,15.75 v7.49,15.75
  Top 0.61: C3.1 6.27,10.29 v5.43,9.46
  Bottom 0.203: 5.43,8.54 R15.2
  Bottom 0.254: R7$DNP.1 13.14,31.98 EEPROM$DNP.4 13.14,31.38 12.47,30.71 12.47,28.4 12.67,28.19 C9$DNP.1 | 14.04,26.72 R6$DNP.1
  Bottom 0.406: 9.23,5.49 11.39,5.49 v11.54,5.33
  Bottom 0.508: v7.49,15.75 7.41,15.82 7.41,23.34 8.48,24.41 | 8.48,24.41 8.48,25.91 v8.63,25.91 | 8.48,24.41 9.25,23.64 14.03,23.64 | C9$DNP.1 12.9,26.72 14.04,26.72 14.79,26.72 15.27,26.24 15.27,24.77 14.14,23.64 14.03,23.64 | v15.36,21.54 14.58,22.32 C7.1 14.58,23.08 14.03,23.64
  Bottom 0.61: v5.43,9.46 5.43,8.54 5.43,8.5 5.94,7.98 9.22,7.98 IC3.5 9.23,5.49 8.22,5.49 7.69,4.95 2.43,4.95 K2$DNP.13
VRAW
  Top 0.254: 3.83,6.73 3.79,6.69 | 3.79,6.69 3.7,6.62 | R14.2 3.79,6.63 3.79,6.69
  Top 0.508: K2$DNP.14 3.83,3.81 3.83,6.73 3.83,7.02 5.1,8.29 5.66,8.29 6.29,8.93 10.21,8.93 D2.SMALL 10.19,9.07 10.75,9.63 R13.2
VREF
  Top 0.254: 6.4,3.41 6.8,3.81 6.8,5.46 7.28,5.94 7.28,7.34 6.98,7.65 R11.1 | 6.4,3.41 IC5.3 | R8.1 6.4,2.11 6.4,3.41
VSHARE  (via drill 0.38)
  Top 0.508: C5.1 10.19,6.16 D2.BIG 10.19,4.85 10.74,4.3 Q3.3
  Top 0.61: 9.83,6.5 9.8,6.55 | 9.83,6.5 D2.BIG | v8.07,6.49 9.83,6.49 9.83,6.5
  Bottom 0.61: v8.07,6.49 5.75,6.49 F1.2
VSHARE_FUSED
  Bottom 0.61: IC3.3 10.74,2.67 10.36,3.05 8.07,3.05 7.61,2.59 F1.1 5.62,2.55
X1
  Top 0.203: IC1.4 10.05,25.71 arc48 9.77,26.54 9.39,26.92 arc-31 9.19,27.23 arc-20 9.11,27.53 9.11,28.6 arc-90 9.82,29.29 10.09,29.29 10.09,29.53 X1.3 10.52,29.42 10.52,29.63 10.9,30.02 11.88,30.02 arc90 12.48,30.5 C2.2
X2
  Top 0.203: 7.6,27.62 X1.1 | IC1.5 9.4,25.86 arc90 8.59,26.67 7.18,26.67 arc-90 6.78,27.08 arc-90 7.18,27.51 7.6,27.51 7.6,27.62 | C1.2 6.65,29.32 6.65,28.75 arc90 7.33,27.94 7.6,27.94 7.6,27.62

### Text on the board
tPlace: P1 | P2 | P0 | P3 | CTS | P | TXD | SCL | RXD | SDA | RTS | P5 | D- | P6 | A7 | D+ | SCK | A5 | A3 | SEL | A2 | MISO | A1 | MOSI | A0 | 3v3 | V | IN | GND
bPlace: outbreak.co/galago | 24Cxx | EEPROM | 0bAb | 040D | KM | 2012
tTest: Outbreak Galago | Version 0BAB-040D (Top Side)
bTest: Outbreak Galago | Version 0BAB-040D (Bottom Side)
Reference: G | GALAGO